# Altium schematic sheet 4 - Output.SchDoc
size A4
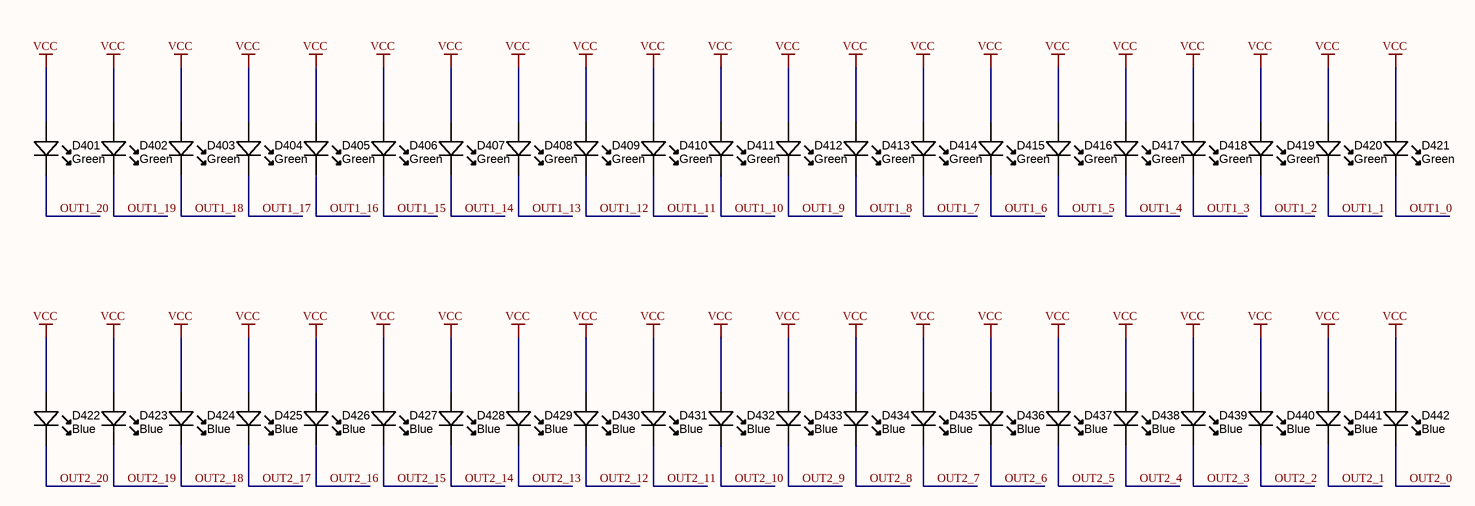
[diagram p0: 4 - Output.SchDoc]

## Parts
D401  Green  [LED-0805S-SIDELED-2.1X0.6X1.0]
D402  Green  [LED-0805S-SIDELED-2.1X0.6X1.0]
D403  Green  [LED-0805S-SIDELED-2.1X0.6X1.0]
D404  Green  [LED-0805S-SIDELED-2.1X0.6X1.0]
D405  Green  [LED-0805S-SIDELED-2.1X0.6X1.0]
D406  Green  [LED-0805S-SIDELED-2.1X0.6X1.0]
D407  Green  [LED-0805S-SIDELED-2.1X0.6X1.0]
D408  Green  [LED-0805S-SIDELED-2.1X0.6X1.0]
D409  Green  [LED-0805S-SIDELED-2.1X0.6X1.0]
D410  Green  [LED-0805S-SIDELED-2.1X0.6X1.0]
D411  Green  [LED-0805S-SIDELED-2.1X0.6X1.0]
D412  Green  [LED-0805S-SIDELED-2.1X0.6X1.0]
D413  Green  [LED-0805S-SIDELED-2.1X0.6X1.0]
D414  Green  [LED-0805S-SIDELED-2.1X0.6X1.0]
D415  Green  [LED-0805S-SIDELED-2.1X0.6X1.0]
D416  Green  [LED-0805S-SIDELED-2.1X0.6X1.0]
D417  Green  [LED-0805S-SIDELED-2.1X0.6X1.0]
D418  Green  [LED-0805S-SIDELED-2.1X0.6X1.0]
D419  Green  [LED-0805S-SIDELED-2.1X0.6X1.0]
D420  Green  [LED-0805S-SIDELED-2.1X0.6X1.0]
D421  Green  [LED-0805S-SIDELED-2.1X0.6X1.0]
D422  Blue  [LED-0805S-SIDELED-2.1X0.6X1.0]
D423  Blue  [LED-0805S-SIDELED-2.1X0.6X1.0]
D424  Blue  [LED-0805S-SIDELED-2.1X0.6X1.0]
D425  Blue  [LED-0805S-SIDELED-2.1X0.6X1.0]
D426  Blue  [LED-0805S-SIDELED-2.1X0.6X1.0]
D427  Blue  [LED-0805S-SIDELED-2.1X0.6X1.0]
D428  Blue  [LED-0805S-SIDELED-2.1X0.6X1.0]
D429  Blue  [LED-0805S-SIDELED-2.1X0.6X1.0]
D430  Blue  [LED-0805S-SIDELED-2.1X0.6X1.0]
D431  Blue  [LED-0805S-SIDELED-2.1X0.6X1.0]
D432  Blue  [LED-0805S-SIDELED-2.1X0.6X1.0]
D433  Blue  [LED-0805S-SIDELED-2.1X0.6X1.0]
D434  Blue  [LED-0805S-SIDELED-2.1X0.6X1.0]
D435  Blue  [LED-0805S-SIDELED-2.1X0.6X1.0]
D436  Blue  [LED-0805S-SIDELED-2.1X0.6X1.0]
D437  Blue  [LED-0805S-SIDELED-2.1X0.6X1.0]
D438  Blue  [LED-0805S-SIDELED-2.1X0.6X1.0]
D439  Blue  [LED-0805S-SIDELED-2.1X0.6X1.0]
D440  Blue  [LED-0805S-SIDELED-2.1X0.6X1.0]
D441  Blue  [LED-0805S-SIDELED-2.1X0.6X1.0]
D442  Blue  [LED-0805S-SIDELED-2.1X0.6X1.0]

## Nets
VCC: D401.A D402.A D403.A D404.A D405.A D406.A D407.A D408.A D409.A D410.A D411.A D412.A D413.A D414.A D415.A D416.A D417.A D418.A D419.A D420.A D421.A D422.A D423.A D424.A D425.A D426.A D427.A D428.A D429.A D430.A D431.A D432.A D433.A D434.A D435.A D436.A D437.A D438.A D439.A D440.A D441.A D442.A
OUT1_0: D421.K
OUT1_1: D420.K
OUT1_2: D419.K
OUT1_3: D418.K
OUT1_4: D417.K
OUT1_5: D416.K
OUT1_6: D415.K
OUT1_7: D414.K
OUT1_8: D413.K
OUT1_9: D412.K
OUT1_10: D411.K
OUT1_11: D410.K
OUT1_12: D409.K
OUT1_13: D408.K
OUT1_14: D407.K
OUT1_15: D406.K
OUT1_16: D405.K
OUT1_17: D404.K
OUT1_18: D403.K
OUT1_19: D402.K
OUT1_20: D401.K
OUT2_0: D442.K
OUT2_1: D441.K
OUT2_2: D440.K
OUT2_3: D439.K
OUT2_4: D438.K
OUT2_5: D437.K
OUT2_6: D436.K
OUT2_7: D435.K
OUT2_8: D434.K
OUT2_9: D433.K
OUT2_10: D432.K
OUT2_11: D431.K
OUT2_12: D430.K
OUT2_13: D429.K
OUT2_14: D428.K
OUT2_15: D427.K
OUT2_16: D426.K
OUT2_17: D425.K
OUT2_18: D424.K
OUT2_19: D423.K
OUT2_20: D422.K

## Library data of the parts
D401-D442 = LED_SMD_PureGreen_0805RA_250mcd: LED 0805 SIDELED SMD Green 250mcd 525nm; Manufacturer 1: Kingbright Corp; Manufacturer Part Number 1: APA2106ZGC; Material: InGaN; Ratings: 250 mcd; 525 nm; SCDType: source; Package / Case: 2.1x0.6x1.0mm SIDELED; Supplier 1: Digi-Key; Supplier Part Number 1: 754-1062-1-ND
  D401-D421: Value: Green; Color: Green
  D422-D442: Value: Blue; Color: Blue